# Altium schematic sheet Flexible Clock & Configuration.SchDoc: Cypress Molson - Flexible Clock & Configuration
size C; DrawnBy: G. Cosens; Engineer: G. Cosens; Organization: Linear Systems Ltd.; Address1: 1-1717 Dublin Ave.; Address2: Winnipeg, MB, Canada; Address3: R3H 0H2; DocumentNumber: LS7652; Revision: 1; SheetNumber: 07; SheetTotal: 12
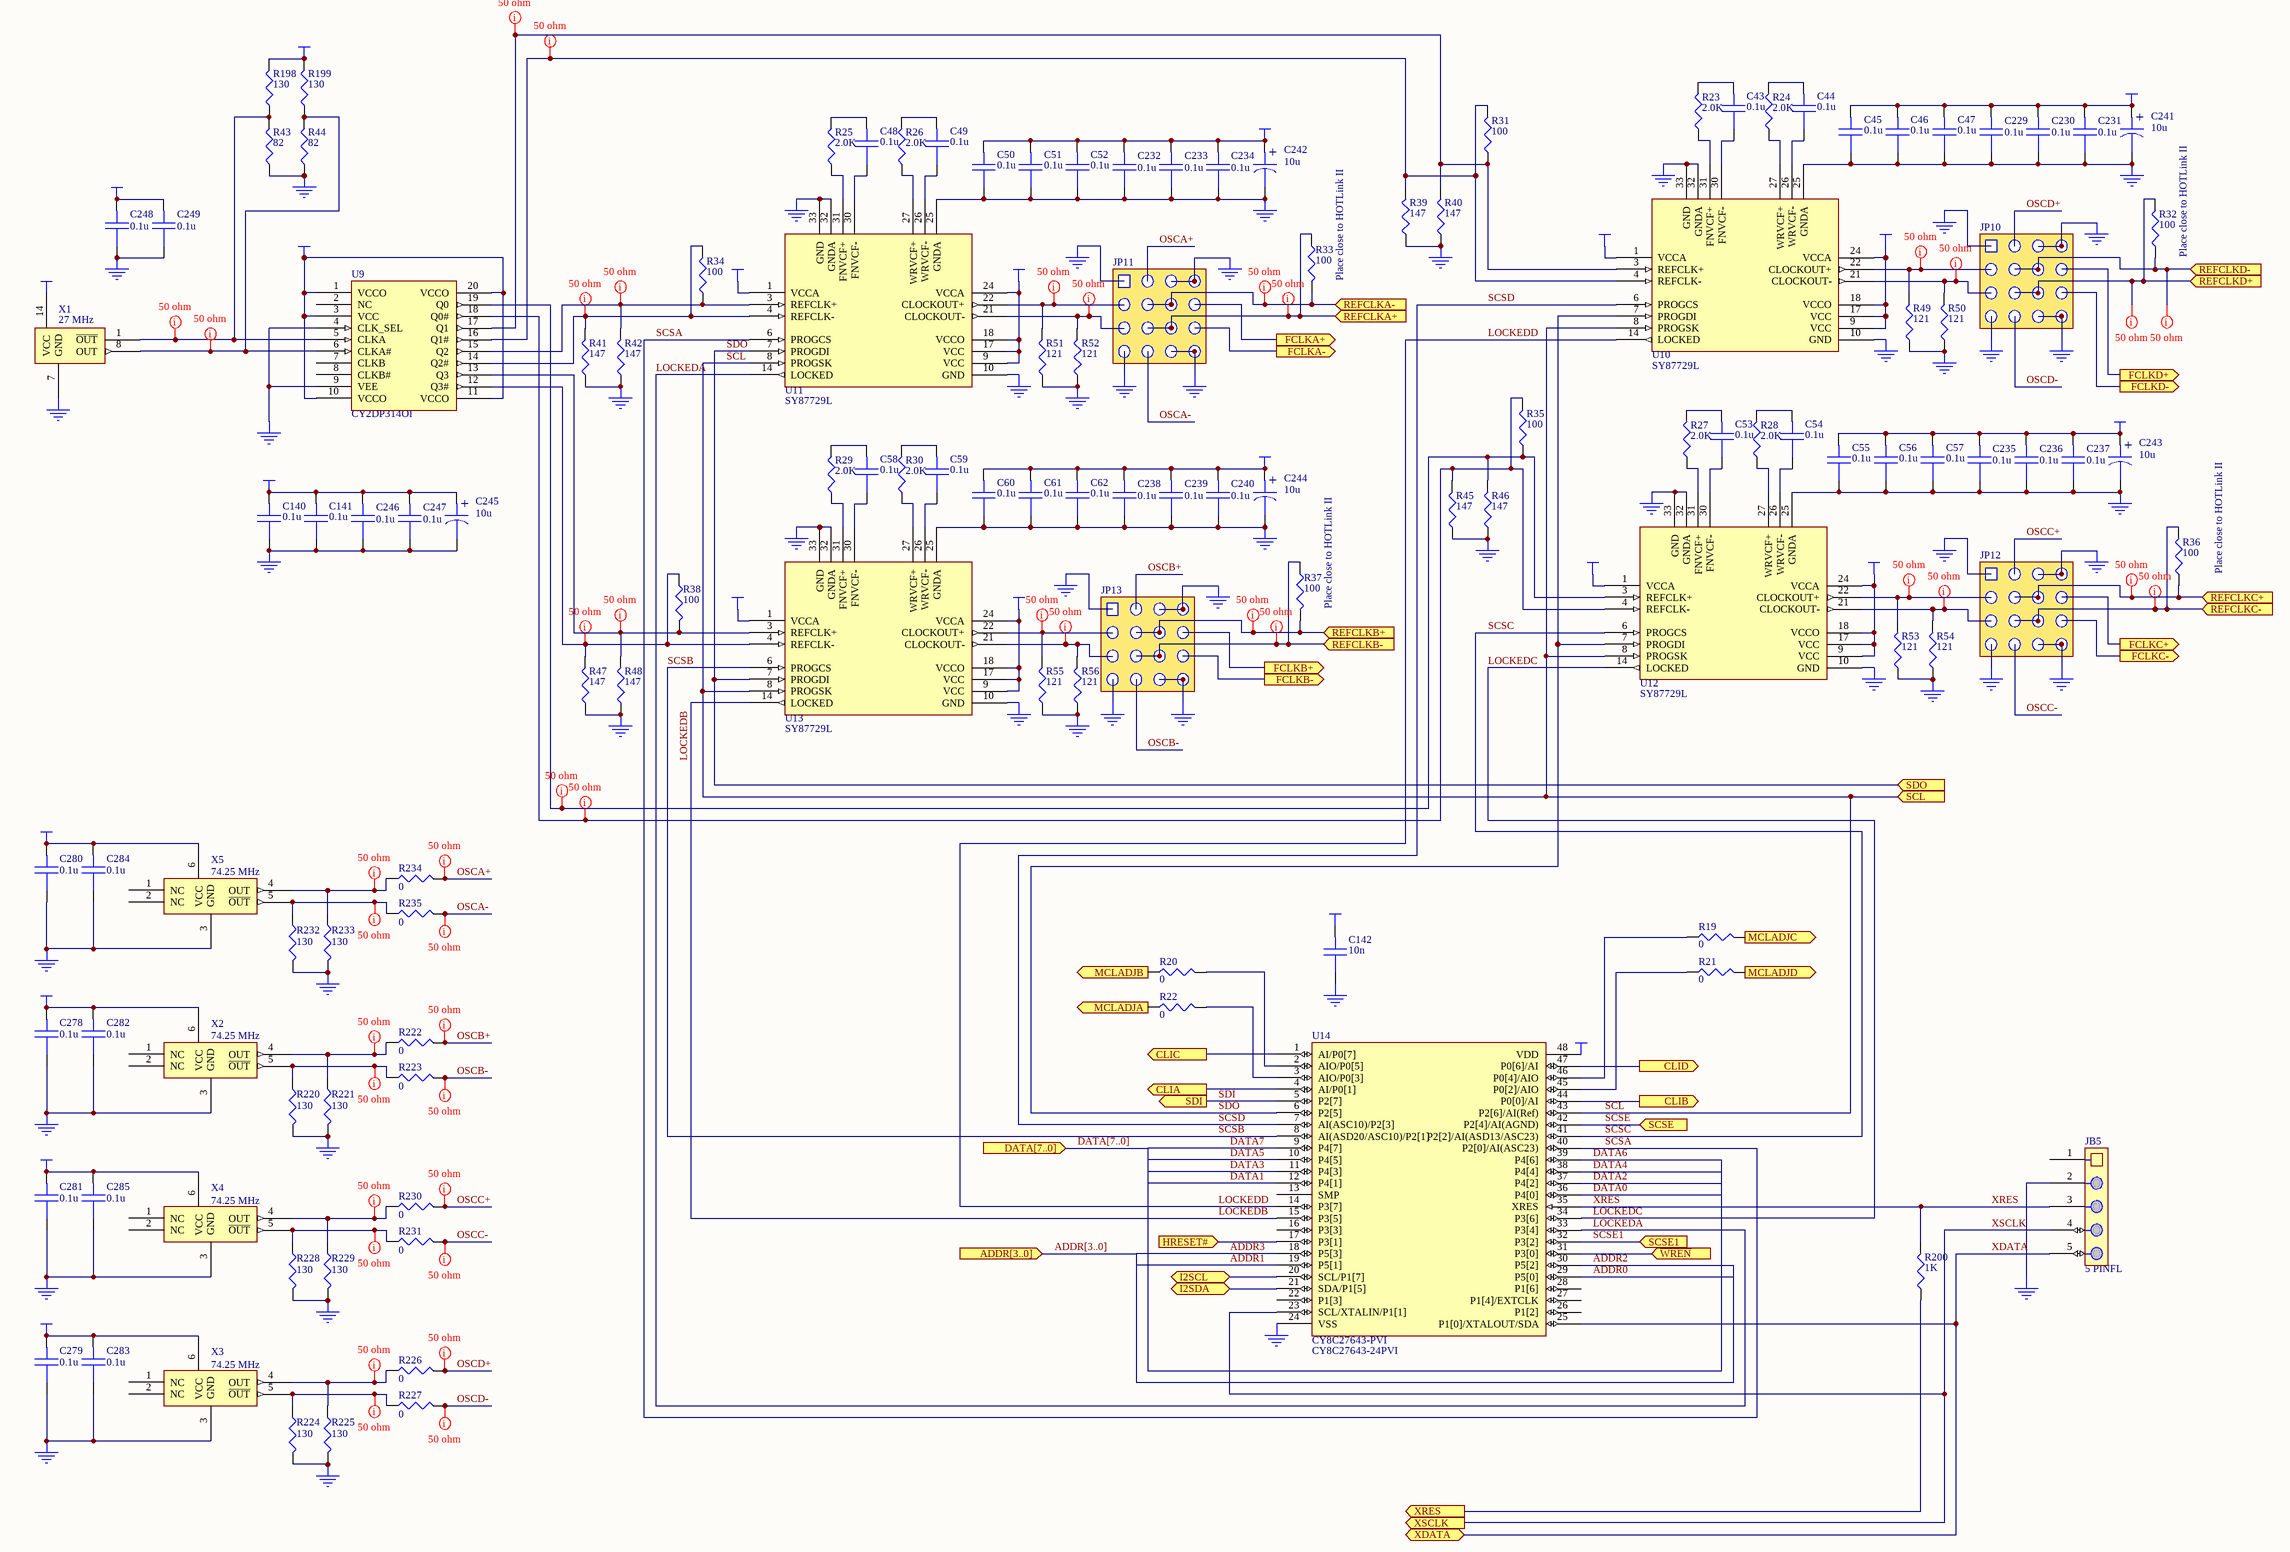
[diagram p0: Flexible Clock & Configuration.SchDoc]

## Parts
C43  (no value)  [0603]
C44  (no value)  [0603]
C45  (no value)  [0603]
C46  (no value)  [0603]
C47  (no value)  [0603]
C48  (no value)  [0603]
C49  (no value)  [0603]
C50  (no value)  [0603]
C51  (no value)  [0603]
C52  (no value)  [0603]
C53  (no value)  [0603]
C54  (no value)  [0603]
C55  (no value)  [0603]
C56  (no value)  [0603]
C57  (no value)  [0603]
C58  (no value)  [0603]
C59  (no value)  [0603]
C60  (no value)  [0603]
C61  (no value)  [0603]
C62  (no value)  [0603]
C140  (no value)  [0603]
C141  (no value)  [0603]
C142  (no value)  [0603]
C229  (no value)  [0603]
C230  (no value)  [0603]
C231  (no value)  [0603]
C232  (no value)  [0603]
C233  (no value)  [0603]
C234  (no value)  [0603]
C235  (no value)  [0603]
C236  (no value)  [0603]
C237  (no value)  [0603]
C238  (no value)  [0603]
C239  (no value)  [0603]
C240  (no value)  [0603]
C241  10u  [6032]
C242  10u  [6032]
C243  10u  [6032]
C244  10u  [6032]
C245  10u  [6032]
C246  (no value)  [0603]
C247  (no value)  [0603]
C248  (no value)  [0603]
C249  (no value)  [0603]
C278  (no value)  [0603]
C279  (no value)  [0603]
C280  (no value)  [0603]
C281  (no value)  [0603]
C282  (no value)  [0603]
C283  (no value)  [0603]
C284  (no value)  [0603]
C285  (no value)  [0603]
JB5  5 PINFL  [5x1 PINFL]
JP10  (no value)  [4X4 PIN]
JP11  (no value)  [4X4 PIN]
JP12  (no value)  [4X4 PIN]
JP13  (no value)  [4X4 PIN]
R19  0  [0603]
R20  0  [0603]
R21  0  [0603]
R22  0  [0603]
R23  2.0K  [0603]
R24  2.0K  [0603]
R25  2.0K  [0603]
R26  2.0K  [0603]
R27  2.0K  [0603]
R28  2.0K  [0603]
R29  2.0K  [0603]
R30  2.0K  [0603]
R31  100  [0603]
R32  100  [0603]
R33  100  [0603]
R34  100  [0603]
R35  100  [0603]
R36  100  [0603]
R37  100  [0603]
R38  100  [0603]
R39  147  [0603]
R40  147  [0603]
R41  147  [0603]
R42  147  [0603]
R43  82  [0603]
R44  82  [0603]
R45  147  [0603]
R46  147  [0603]
R47  147  [0603]
R48  147  [0603]
R49  121  [0603]
R50  121  [0603]
R51  121  [0603]
R52  121  [0603]
R53  121  [0603]
R54  121  [0603]
R55  121  [0603]
R56  121  [0603]
R198  130  [0603]
R199  130  [0603]
R200  1K  [0603]
R220  130  [0603]
R221  130  [0603]
R222  0  [0603]
R223  0  [0603]
R224  130  [0603]
R225  130  [0603]
R226  0  [0603]
R227  0  [0603]
R228  130  [0603]
R229  130  [0603]
R230  0  [0603]
R231  0  [0603]
R232  130  [0603]
R233  130  [0603]
R234  0  [0603]
R235  0  [0603]
U9  CY2DP314OI  [SSO-G20/P.65]
U10  SY87729L  [QFP7x7-G32/N]
U11  SY87729L  [QFP7x7-G32/N]
U12  SY87729L  [QFP7x7-G32/N]
U13  SY87729L  [QFP7x7-G32/N]
U14  CY8C27643-24PVI  [SSO-G48]
X1  27 MHz  [DIP14OSC]
X2  74.25 MHz  [OSC14X9]
X3  74.25 MHz  [OSC14X9]
X4  74.25 MHz  [OSC14X9]
X5  74.25 MHz  [OSC14X9]

## Ports
ADDR[3..0] (in), CLIA (out), CLIB (out), CLIC (out), CLID (out), DATA[7..0] (in), FCLKA+ (out), FCLKA- (out), FCLKB+ (out), FCLKB- (out), FCLKC+ (out), FCLKC- (out), FCLKD+ (out), FCLKD- (out), HRESET# (in), I2SCL (bidir), I2SDA (bidir), MCLADJA (in), MCLADJB (in), MCLADJC (in), MCLADJD (in), REFCLKA+ (in), REFCLKA- (in), REFCLKB+ (in), REFCLKB- (in), REFCLKC+ (in), REFCLKC- (in), REFCLKD+ (in), REFCLKD- (in), SCL (in), SCSE1 (in), SCSE (in), SDI (out), SDO (in), XDATA (bidir), XRES (out), XSCLK (out), ~{WREN} (in)

## Nets
+3.3V: C45.1 C46.1 C47.1 C50.1 C51.1 C52.1 C55.1 C56.1 C57.1 C60.1 C61.1 C62.1 C140.1 C141.1 C142.1 C229.1 C230.1 C231.1 C232.1 C233.1 C234.1 C235.1 C236.1 C237.1 C238.1 C239.1 C240.1 C241.1 C242.1 C243.1 C244.1 C245.1 C246.1 C247.1 C248.1 C249.1 C278.1 C279.1 C280.1 C281.1 C282.1 C283.1 C284.1 C285.1 R198.2 R199.2 U9.1(VCCO) U9.3(VCC) U9.10(VCCO) U9.11(VCCO) U9.20(VCCO) U10.1(VCCA) U10.9(VCC) U10.17(VCC) U10.18(VCCO) U10.24(VCCA) U11.1(VCCA) U11.9(VCC) U11.17(VCC) U11.18(VCCO) U11.24(VCCA) U12.1(VCCA) U12.9(VCC) U12.17(VCC) U12.18(VCCO) U12.24(VCCA) U13.1(VCCA) U13.9(VCC) U13.17(VCC) U13.18(VCCO) U13.24(VCCA) U14.48(VDD) X1.14(VCC) X2.6(VCC) X3.6(VCC) X4.6(VCC) X5.6(VCC)
GND: C45.2 C46.2 C47.2 C50.2 C51.2 C52.2 C55.2 C56.2 C57.2 C60.2 C61.2 C62.2 C140.2 C141.2 C142.2 C229.2 C230.2 C231.2 C232.2 C233.2 C234.2 C235.2 C236.2 C237.2 C238.2 C239.2 C240.2 C241.2 C242.2 C243.2 C244.2 C245.2 C246.2 C247.2 C248.2 C249.2 C278.2 C279.2 C280.2 C281.2 C282.2 C283.2 C284.2 C285.2 JB5.2 JP10.1 JP10.3 JP10.4 JP10.13 JP10.15 JP10.16 JP11.1 JP11.3 JP11.4 JP11.13 JP11.15 JP11.16 JP12.1 JP12.3 JP12.4 JP12.13 JP12.15 JP12.16 JP13.1 JP13.3 JP13.4 JP13.13 JP13.15 JP13.16 R39.1 R40.1 R41.1 R42.1 R43.1 R44.1 R45.1 R46.1 R47.1 R48.1 R49.1 R50.1 R51.1 R52.1 R53.1 R54.1 R55.1 R56.1 R220.2 R221.2 R224.2 R225.2 R228.2 R229.2 R232.2 R233.2 U9.4(CLK_SEL) U9.9(VEE) U10.10(GND) U10.25(GNDA) U10.32(GNDA) U10.33(GND) U11.10(GND) U11.25(GNDA) U11.32(GNDA) U11.33(GND) U12.10(GND) U12.25(GNDA) U12.32(GNDA) U12.33(GND) U13.10(GND) U13.25(GNDA) U13.32(GNDA) U13.33(GND) U14.24(VSS) X1.7(GND) X2.3(GND) X3.3(GND) X4.3(GND) X5.3(GND)
ADDR0: U14.29(P5[0])
ADDR1: U14.19(P5[1])
ADDR2: U14.30(P5[2])
ADDR3: U14.18(P5[3])
CLIA: U14.4(AI/P0[1]) ; port CLIA
CLIB: U14.44(P0[0]/AI) ; port CLIB
CLIC: U14.1(AI/P0[7]) ; port CLIC
CLID: U14.47(P0[6]/AI) ; port CLID
DATA0: U14.36(P4[0])
DATA1: U14.12(P4[1])
DATA2: U14.37(P4[2])
DATA3: U14.11(P4[3])
DATA4: U14.38(P4[4])
DATA5: U14.10(P4[5])
DATA6: U14.39(P4[6])
DATA7: U14.9(P4[7])
FCLKA+: JP11.8 ; port FCLKA+
FCLKA-: JP11.12 ; port FCLKA-
FCLKB+: JP13.8 ; port FCLKB+
FCLKB-: JP13.12 ; port FCLKB-
FCLKC+: JP12.8 ; port FCLKC+
FCLKC-: JP12.12 ; port FCLKC-
FCLKD+: JP10.8 ; port FCLKD+
FCLKD-: JP10.12 ; port FCLKD-
HRESET#: U14.17(P3[1]) ; port HRESET#
I2SCL: U14.20(SCL/P1[7]) ; port I2SCL
I2SDA: U14.21(SDA/P1[5]) ; port I2SDA
LOCKEDA: U11.14(LOCKED) U14.33(P3[4])
LOCKEDB: U13.14(LOCKED) U14.15(P3[5])
LOCKEDC: U12.14(LOCKED) U14.34(P3[6])
LOCKEDD: U10.14(LOCKED) U14.14(P3[7])
MCLADJA: R22.1 ; port MCLADJA
MCLADJB: R20.1 ; port MCLADJB
MCLADJC: R19.2 ; port MCLADJC
MCLADJD: R21.2 ; port MCLADJD
OSCA+: JP11.2 R234.2
OSCA-: JP11.14 R235.2
OSCB+: JP13.2 R222.2
OSCB-: JP13.14 R223.2
OSCC+: JP12.2 R230.2
OSCC-: JP12.14 R231.2
OSCD+: JP10.2 R226.2
OSCD-: JP10.14 R227.2
REFCLKA+: JP11.10 JP11.11 R33.1 ; port REFCLKA+
REFCLKA-: JP11.6 JP11.7 R33.2 ; port REFCLKA-
REFCLKB+: JP13.6 JP13.7 R37.2 ; port REFCLKB+
REFCLKB-: JP13.10 JP13.11 R37.1 ; port REFCLKB-
REFCLKC+: JP12.6 JP12.7 R36.1 ; port REFCLKC+
REFCLKC-: JP12.10 JP12.11 R36.2 ; port REFCLKC-
REFCLKD+: JP10.10 JP10.11 R32.2 ; port REFCLKD+
REFCLKD-: JP10.6 JP10.7 R32.1 ; port REFCLKD-
SCL: U10.8(PROGSK) U11.8(PROGSK) U12.8(PROGSK) U13.8(PROGSK) U14.43(P2[6]/AI(Ref)) ; port SCL
SCSA: U11.6(PROGCS) U14.40(P2[0]/AI(ASC23))
SCSB: U13.6(PROGCS) U14.8(AI(ASD20/ASC10)/P2[1])
SCSC: U12.6(PROGCS) U14.41(P2[2]/AI(ASD13/ASC23))
SCSD: U10.6(PROGCS) U14.7(AI(ASC10)/P2[3])
SCSE: U14.42(P2[4]/AI(AGND)) ; port SCSE
SCSE1: U14.32(P3[2]) ; port SCSE1
SDI: U14.5(P2[7]) ; port SDI
SDO: U10.7(PROGDI) U11.7(PROGDI) U12.7(PROGDI) U13.7(PROGDI) U14.6(P2[5]) ; port SDO
~{WREN}: U14.31(P3[0]) ; port ~{WREN}
XDATA: JB5.5 U14.25(P1[0]/XTALOUT/SDA) ; port XDATA
XRES: JB5.3 R200.2 U14.35(XRES)
XRES: R200.1 ; port XRES  [a separate net that carries the same name]
XSCLK: JB5.4 U14.23(SCL/XTALIN/P1[1]) ; port XSCLK
NetC43_1: C43.1 R23.2
NetC43_2: C43.2 U10.30(FNVCF-)
NetC44_1: C44.1 R24.2
NetC44_2: C44.2 U10.26(WRVCF-)
NetC48_1: C48.1 R25.2
NetC48_2: C48.2 U11.30(FNVCF-)
NetC49_1: C49.1 R26.2
NetC49_2: C49.2 U11.26(WRVCF-)
NetC53_1: C53.1 R27.2
NetC53_2: C53.2 U12.30(FNVCF-)
NetC54_1: C54.1 R28.2
NetC54_2: C54.2 U12.26(WRVCF-)
NetC58_1: C58.1 R29.2
NetC58_2: C58.2 U13.30(FNVCF-)
NetC59_1: C59.1 R30.2
NetC59_2: C59.2 U13.26(WRVCF-)
NetJP10_5: JP10.5 R49.2 U10.22(CLOCKOUT+)
NetJP10_9: JP10.9 R50.2 U10.21(CLOCKOUT-)
NetJP11_5: JP11.5 R51.2 U11.22(CLOCKOUT+)
NetJP11_9: JP11.9 R52.2 U11.21(CLOCKOUT-)
NetJP12_5: JP12.5 R53.2 U12.22(CLOCKOUT+)
NetJP12_9: JP12.9 R54.2 U12.21(CLOCKOUT-)
NetJP13_5: JP13.5 R55.2 U13.22(CLOCKOUT+)
NetJP13_9: JP13.9 R56.2 U13.21(CLOCKOUT-)
NetR19_1: R19.1 U14.46(P0[4]/AIO)
NetR20_2: R20.2 U14.2(AIO/P0[5])
NetR21_1: R21.1 U14.45(P0[2]/AIO)
NetR22_2: R22.2 U14.3(AIO/P0[3])
NetR23_1: R23.1 U10.31(FNVCF+)
NetR24_1: R24.1 U10.27(WRVCF+)
NetR25_1: R25.1 U11.31(FNVCF+)
NetR26_1: R26.1 U11.27(WRVCF+)
NetR27_1: R27.1 U12.31(FNVCF+)
NetR28_1: R28.1 U12.27(WRVCF+)
NetR29_1: R29.1 U13.31(FNVCF+)
NetR30_1: R30.1 U13.27(WRVCF+)
NetR31_1: R31.1 R40.2 U9.17(Q1) U10.3(REFCLK+)
NetR31_2: R31.2 R39.2 U9.16(Q1#) U10.4(REFCLK-)
NetR34_1: R34.1 R42.2 U9.15(Q2) U11.3(REFCLK+)
NetR34_2: R34.2 R41.2 U9.14(Q2#) U11.4(REFCLK-)
NetR35_1: R35.1 R46.2 U9.19(Q0) U12.3(REFCLK+)
NetR35_2: R35.2 R45.2 U9.18(Q0#) U12.4(REFCLK-)
NetR38_1: R38.1 R47.2 U9.12(Q3#) U13.4(REFCLK-)
NetR38_2: R38.2 R48.2 U9.13(Q3) U13.3(REFCLK+)
NetR43_2: R43.2 R198.1 U9.5(CLKA) X1.1(~{OUT})
NetR44_2: R44.2 R199.1 U9.6(CLKA#) X1.8(OUT)
NetR220_1: R220.1 R223.1 X2.5(~{OUT})
NetR221_1: R221.1 R222.1 X2.4(OUT)
NetR224_1: R224.1 R227.1 X3.5(~{OUT})
NetR225_1: R225.1 R226.1 X3.4(OUT)
NetR228_1: R228.1 R231.1 X4.5(~{OUT})
NetR229_1: R229.1 R230.1 X4.4(OUT)
NetR232_1: R232.1 R235.1 X5.5(~{OUT})
NetR233_1: R233.1 R234.1 X5.4(OUT)

Not connected (* = marked no-connect by the designer): JB5 1; U9 2(NC) 7(CLKB) 8(CLKB#); U14 13(SMP) 16(P3[3]) 22(P1[3]) 26(P1[2]) 27(P1[4]/EXTCLK) 28(P1[6]); X2 1(NC) 2(NC); X3 1(NC) 2(NC); X4 1(NC) 2(NC); X5 1(NC) 2(NC)

## Buses and harness runs
bus ADDR[3..0] = port ADDR[3..0]
bus DATA[7..0] = port DATA[7..0]

## Layout directives
rule Width Constraint [Pref Width = 10mil    Min Width = 10mil    Max Width = 10mil]: NetJP10_5, NetJP10_9, NetJP11_5, NetJP11_9, NetJP12_5, NetJP12_9, NetJP13_5, NetJP13_9, NetR31_1, NetR31_2, NetR34_1, NetR34_2, NetR35_1, NetR35_2, NetR38_1, NetR38_2, NetR43_2, NetR44_2, NetR220_1, NetR221_1, NetR224_1, NetR225_1, NetR228_1, NetR229_1, NetR232_1, NetR233_1, OSCA+, OSCA-, OSCB+, OSCB-, OSCC+, OSCC-, OSCD+, OSCD-, REFCLKA+, REFCLKA-, REFCLKB+, REFCLKB-, REFCLKC+, REFCLKC-, REFCLKD+, REFCLKD-

## Notes on the sheet
- (near R32) Place close to HOTLink II
- (near R33) Place close to HOTLink II
- (near R37) Place close to HOTLink II
- (near R36) Place close to HOTLink II
- Size
- Date:
- File:
- B
- Drawing Number
- Sheet
- Drawn By:
- G. Cosens
- Revision
- of
- (in symbol CAPACITOR POL) +
- (in symbol CY8C27643-24PVI) CY8C27643-PVI

## Library data of the parts
C43-C62 C140-C142 C229-C240 C246-C249 C278-C285 = CAP: SMT CAP
C241-C245 = CAPACITOR POL: Text Field1: 20; Text Field2: 20
JB5 = 5 PINFL: 5x1 Pin Friction Lock
JP10-JP13 = HEADER 4X4
R19-R56 R198-R200 R220-R235 = RES1
U9 = CY2DP314
X1 = PECL OSCILLATOR: PECL OSCILLATOR MODULE
X2-X5 = PECL SMT OSC